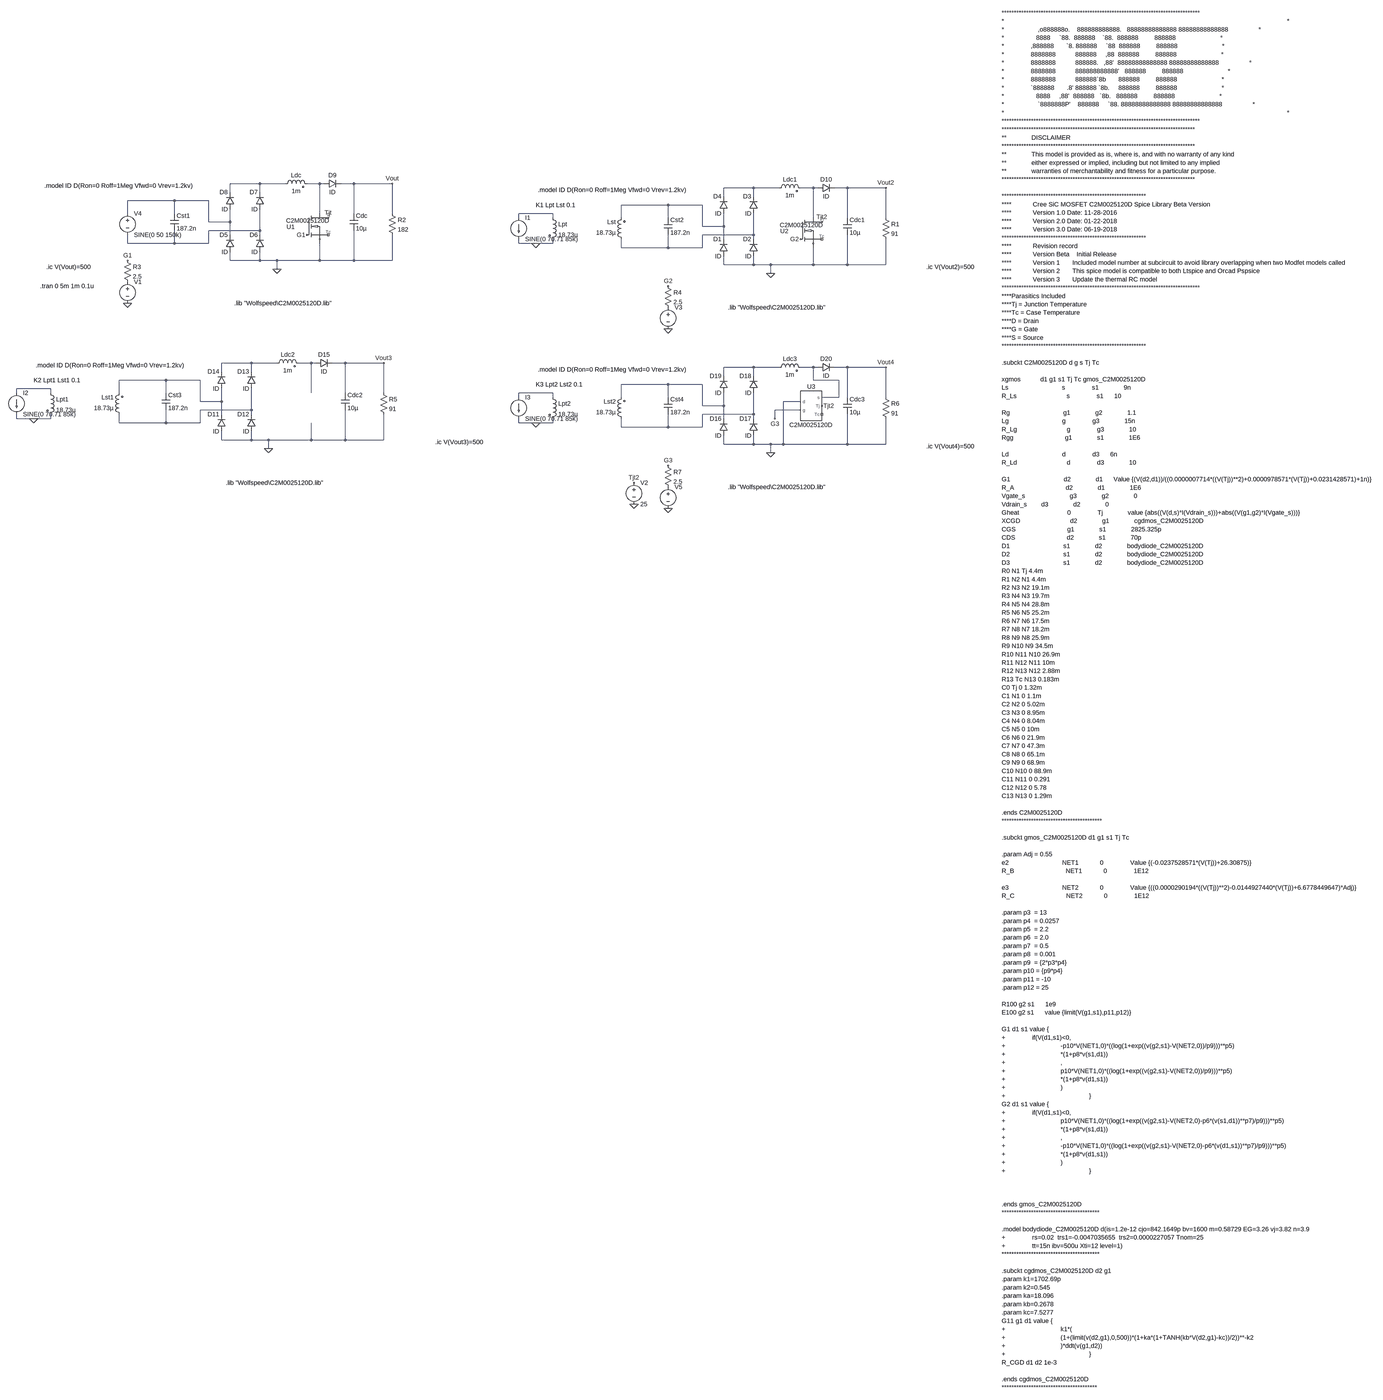
[diagram p0: schematic ShortCctReg.asc, whole sheet]
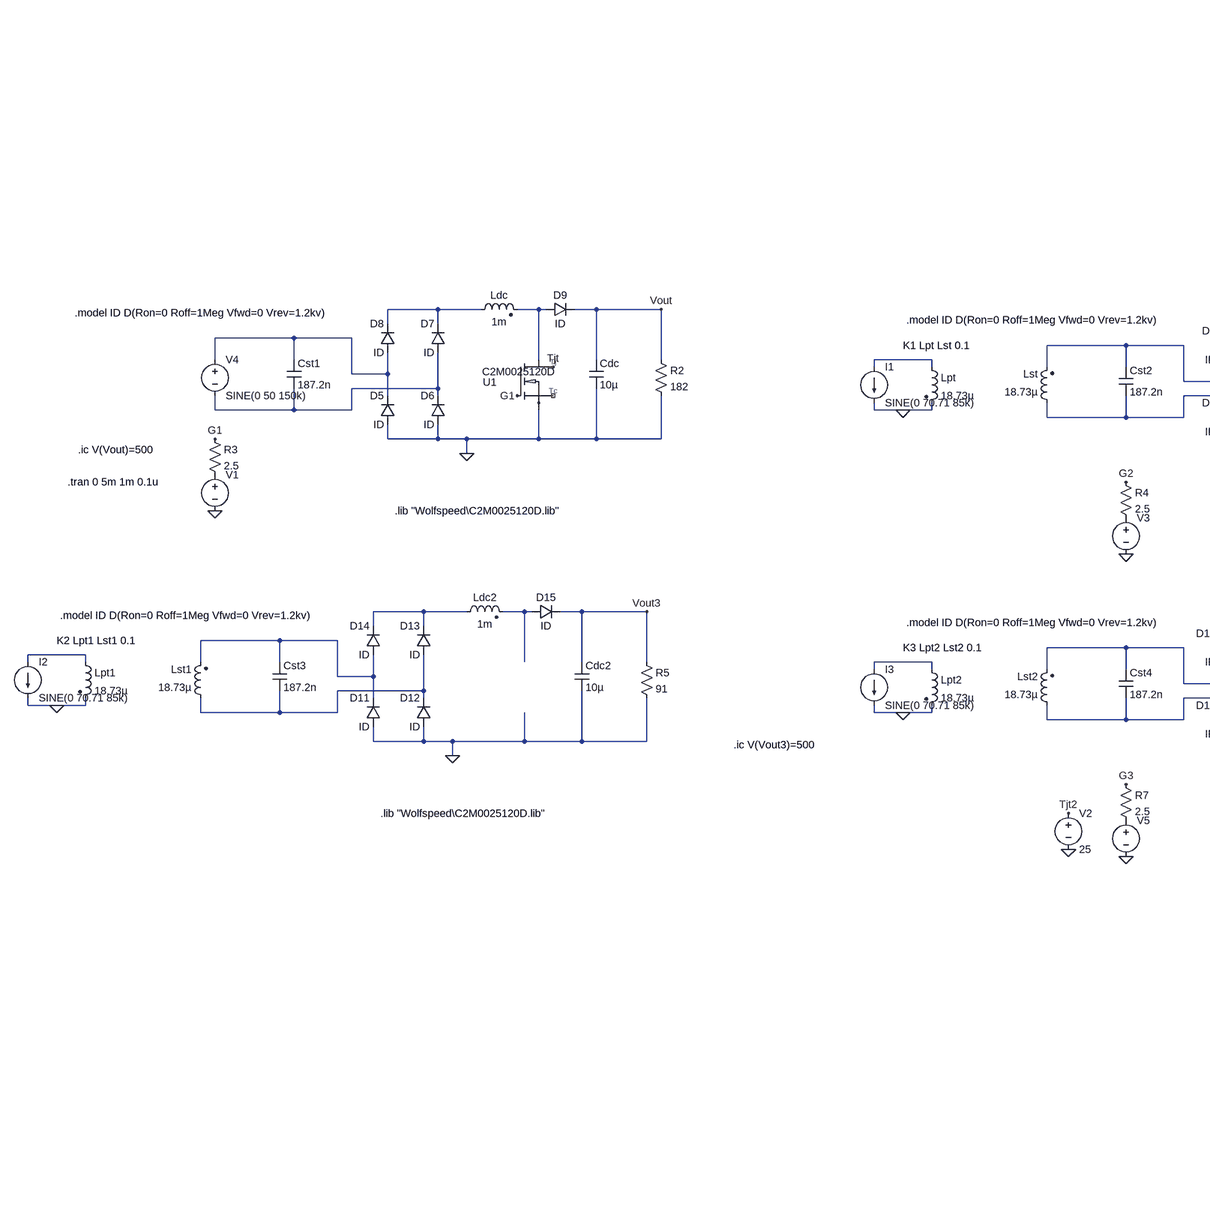
[diagram p1: schematic ShortCctReg.asc, part, row 1 of 2, column 1 of 2]
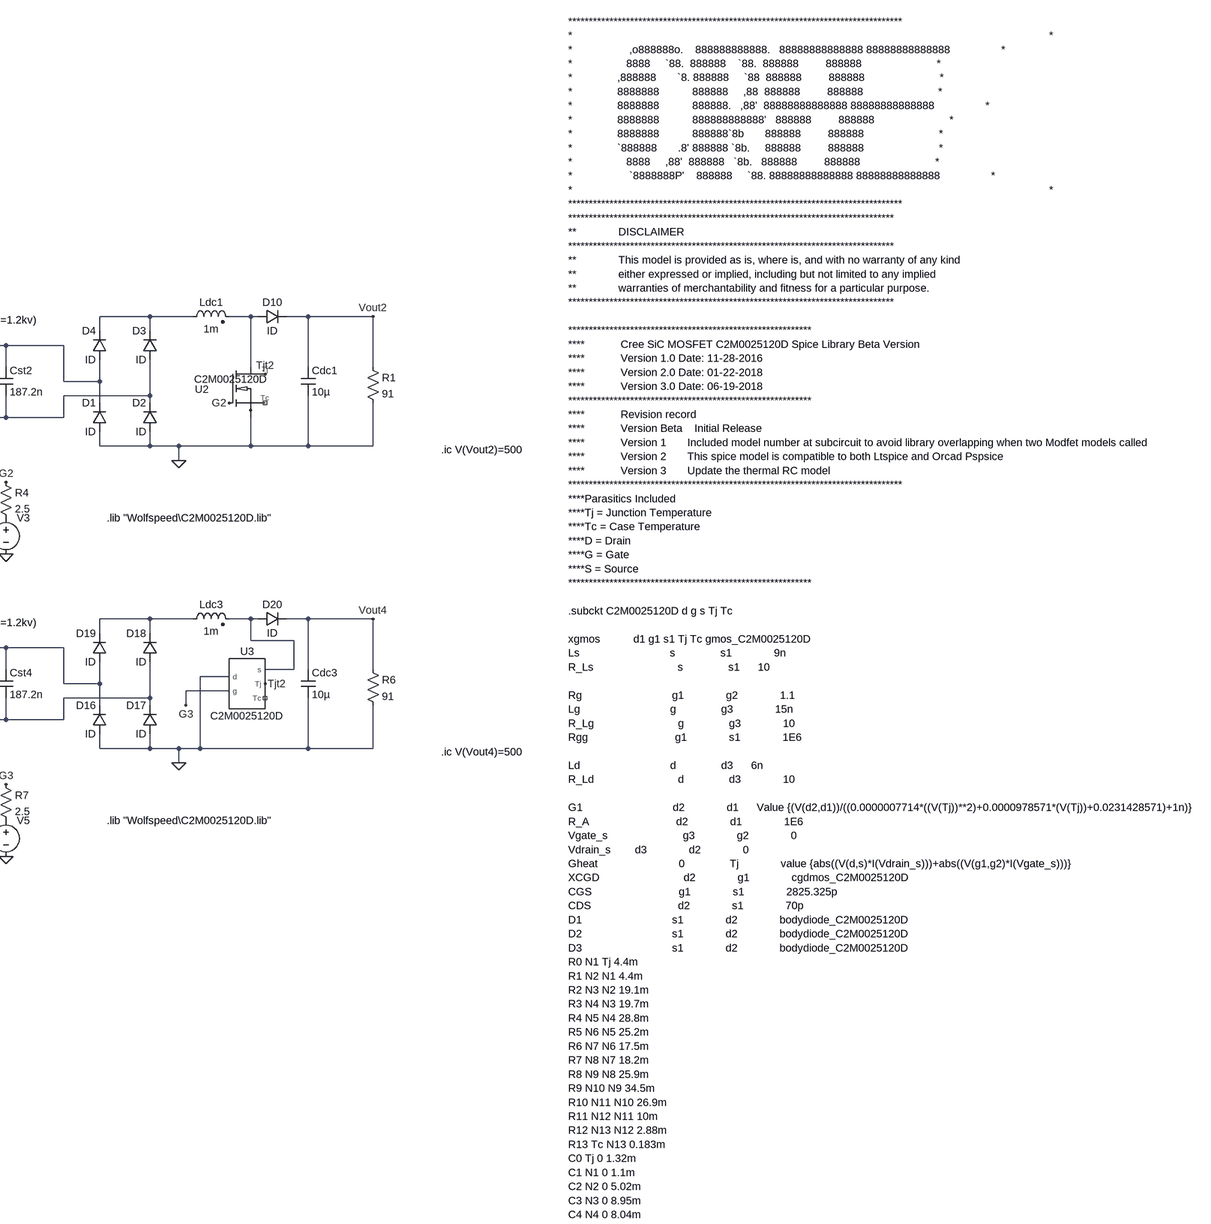
[diagram p2: schematic ShortCctReg.asc, part, row 1 of 2, column 2 of 2]
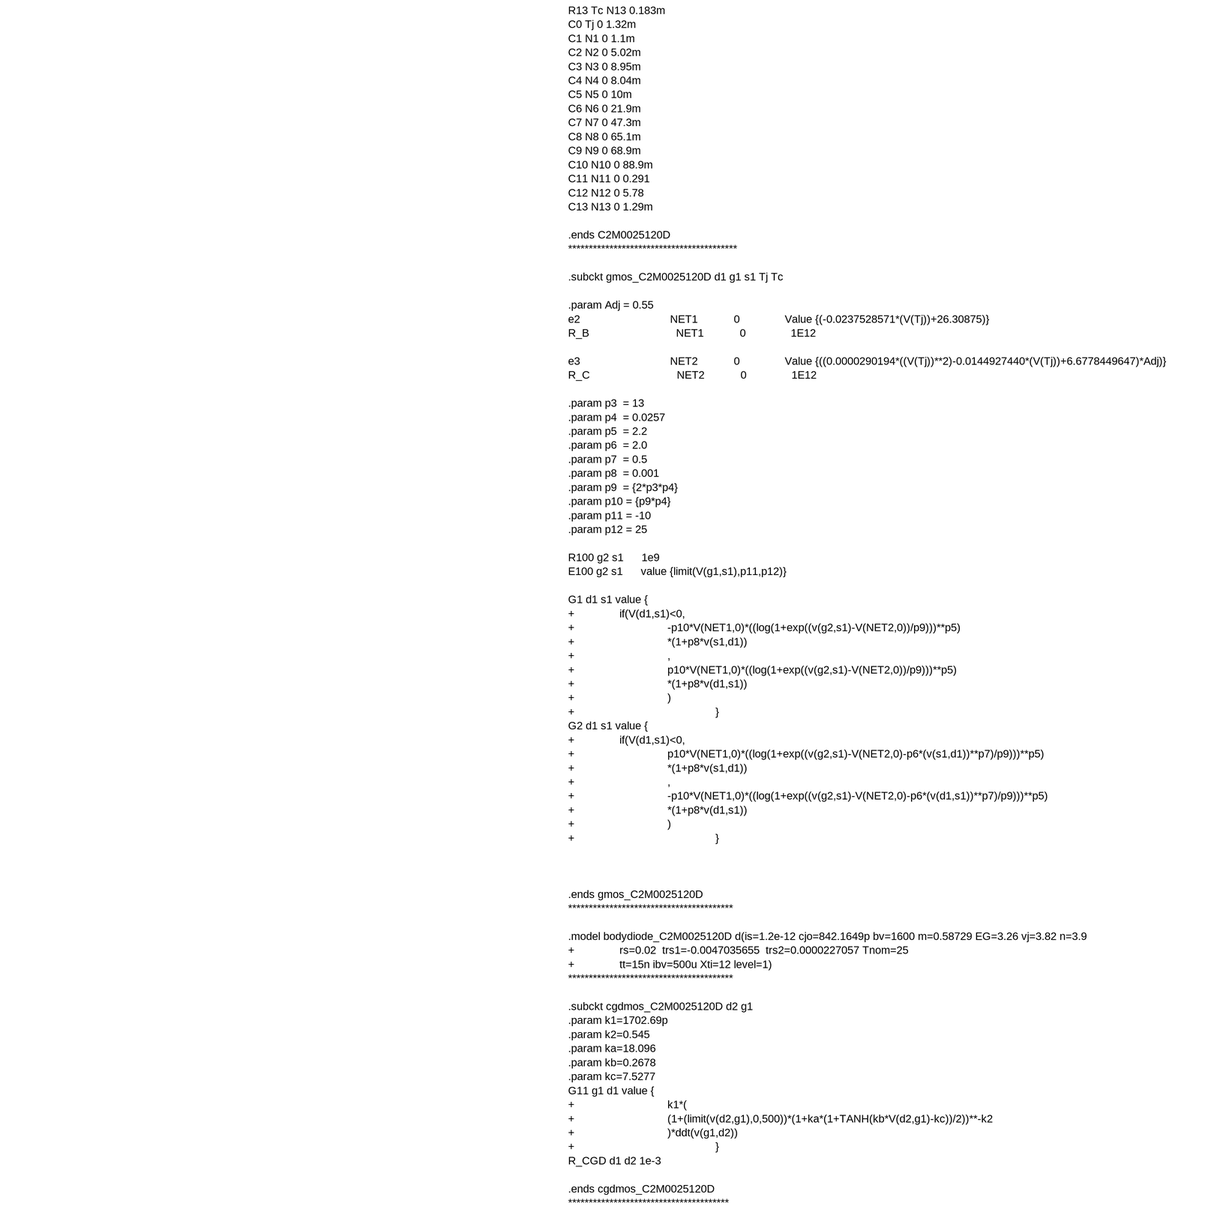
[diagram p3: schematic ShortCctReg.asc, part, row 2 of 2, column 2 of 2]
ShortCctReg.asc, the LTspice schematic file:
Version 4
SHEET 1 6276 4384
WIRE 544 416 432 416
WIRE 640 416 544 416
WIRE 768 416 720 416
WIRE 784 416 768 416
WIRE 896 416 848 416
WIRE 1040 416 896 416
WIRE 2592 432 2480 432
WIRE 2688 432 2592 432
WIRE 2816 432 2768 432
WIRE 2832 432 2816 432
WIRE 2944 432 2896 432
WIRE 3088 432 2944 432
WIRE 432 448 432 416
WIRE 544 448 544 416
WIRE 2480 464 2480 432
WIRE 2592 464 2592 432
WIRE 224 480 48 480
WIRE 352 480 224 480
WIRE 2272 496 2096 496
WIRE 2400 496 2272 496
WIRE 48 528 48 480
WIRE 224 528 224 480
WIRE 768 528 768 416
WIRE 896 528 896 416
WIRE 1040 528 1040 416
WIRE 1840 528 1712 528
WIRE 1712 544 1712 528
WIRE 1840 544 1840 528
WIRE 2096 544 2096 496
WIRE 2272 544 2272 496
WIRE 2816 544 2816 432
WIRE 2944 544 2944 432
WIRE 3088 544 3088 432
WIRE 352 560 352 480
WIRE 432 560 432 512
WIRE 432 560 352 560
WIRE 2400 576 2400 496
WIRE 2480 576 2480 528
WIRE 2480 576 2400 576
WIRE 544 592 544 512
WIRE 544 592 352 592
WIRE 432 608 432 560
WIRE 544 608 544 592
WIRE 2592 608 2592 528
WIRE 2592 608 2400 608
WIRE 2480 624 2480 576
WIRE 2592 624 2592 608
WIRE 48 640 48 608
WIRE 224 640 224 592
WIRE 224 640 48 640
WIRE 352 640 352 592
WIRE 352 640 224 640
WIRE 1712 640 1712 624
WIRE 1776 640 1712 640
WIRE 1840 640 1840 624
WIRE 1840 640 1776 640
WIRE 2096 656 2096 624
WIRE 2272 656 2272 608
WIRE 2272 656 2096 656
WIRE 2400 656 2400 608
WIRE 2400 656 2272 656
WIRE 432 704 432 672
WIRE 544 704 544 672
WIRE 544 704 432 704
WIRE 608 704 544 704
WIRE 768 704 768 640
WIRE 768 704 608 704
WIRE 896 704 896 592
WIRE 896 704 768 704
WIRE 1040 704 1040 608
WIRE 1040 704 896 704
WIRE 2480 720 2480 688
WIRE 2592 720 2592 688
WIRE 2592 720 2480 720
WIRE 2656 720 2592 720
WIRE 2816 720 2816 656
WIRE 2816 720 2656 720
WIRE 2944 720 2944 608
WIRE 2944 720 2816 720
WIRE 3088 720 3088 624
WIRE 3088 720 2944 720
WIRE 608 736 608 704
WIRE 2656 752 2656 720
WIRE 512 1088 400 1088
WIRE 608 1088 512 1088
WIRE 736 1088 688 1088
WIRE 752 1088 736 1088
WIRE 864 1088 816 1088
WIRE 1008 1088 864 1088
WIRE 2592 1104 2480 1104
WIRE 2688 1104 2592 1104
WIRE 2816 1104 2768 1104
WIRE 2832 1104 2816 1104
WIRE 2944 1104 2896 1104
WIRE 3088 1104 2944 1104
WIRE 400 1120 400 1088
WIRE 512 1120 512 1088
WIRE 2480 1136 2480 1104
WIRE 2592 1136 2592 1104
WIRE 192 1152 16 1152
WIRE 320 1152 192 1152
WIRE 2816 1152 2816 1104
WIRE 2912 1152 2816 1152
WIRE 2272 1168 2096 1168
WIRE 2400 1168 2272 1168
WIRE -240 1184 -368 1184
WIRE -368 1200 -368 1184
WIRE -240 1200 -240 1184
WIRE 16 1200 16 1152
WIRE 192 1200 192 1152
WIRE 736 1200 736 1088
WIRE 864 1200 864 1088
WIRE 1008 1200 1008 1088
WIRE 1840 1200 1712 1200
WIRE 1712 1216 1712 1200
WIRE 1840 1216 1840 1200
WIRE 2096 1216 2096 1168
WIRE 2272 1216 2272 1168
WIRE 2912 1216 2912 1152
WIRE 2912 1216 2848 1216
WIRE 2944 1216 2944 1104
WIRE 3088 1216 3088 1104
WIRE 320 1232 320 1152
WIRE 400 1232 400 1184
WIRE 400 1232 320 1232
WIRE 2768 1232 2704 1232
WIRE 2400 1248 2400 1168
WIRE 2480 1248 2480 1200
WIRE 2480 1248 2400 1248
WIRE 512 1264 512 1184
WIRE 512 1264 320 1264
WIRE 2768 1264 2672 1264
WIRE 400 1280 400 1232
WIRE 512 1280 512 1264
WIRE 2592 1280 2592 1200
WIRE 2592 1280 2400 1280
WIRE -368 1296 -368 1280
WIRE -304 1296 -368 1296
WIRE -240 1296 -240 1280
WIRE -240 1296 -304 1296
WIRE 2480 1296 2480 1248
WIRE 2592 1296 2592 1280
WIRE 2672 1296 2672 1264
WIRE 16 1312 16 1280
WIRE 192 1312 192 1264
WIRE 192 1312 16 1312
WIRE 320 1312 320 1264
WIRE 320 1312 192 1312
WIRE 1712 1312 1712 1296
WIRE 1776 1312 1712 1312
WIRE 1840 1312 1840 1296
WIRE 1840 1312 1776 1312
WIRE 2096 1328 2096 1296
WIRE 2272 1328 2272 1280
WIRE 2272 1328 2096 1328
WIRE 2400 1328 2400 1280
WIRE 2400 1328 2272 1328
WIRE 400 1376 400 1344
WIRE 512 1376 512 1344
WIRE 512 1376 400 1376
WIRE 576 1376 512 1376
WIRE 736 1376 736 1312
WIRE 736 1376 576 1376
WIRE 864 1376 864 1264
WIRE 864 1376 736 1376
WIRE 1008 1376 1008 1280
WIRE 1008 1376 864 1376
WIRE 2480 1392 2480 1360
WIRE 2592 1392 2592 1360
WIRE 2592 1392 2480 1392
WIRE 2656 1392 2592 1392
WIRE 2704 1392 2704 1232
WIRE 2704 1392 2656 1392
WIRE 2944 1392 2944 1280
WIRE 2944 1392 2704 1392
WIRE 3088 1392 3088 1296
WIRE 3088 1392 2944 1392
WIRE 576 1408 576 1376
WIRE 2656 1424 2656 1392
FLAG 608 736 0
FLAG 1040 416 Vout
FLAG 2144 1616 0
FLAG 48 864 0
FLAG 48 704 G1
FLAG 720 608 G1
FLAG 2144 1536 Tjt2
FLAG 800 544 Tjt
FLAG 2656 752 0
FLAG 3088 432 Vout2
FLAG 2768 624 G2
FLAG 2848 560 Tjt2
FLAG 2272 960 0
FLAG 2272 800 G2
FLAG 1776 640 0
FLAG 576 1408 0
FLAG 1008 1088 Vout3
FLAG -304 1296 0
FLAG 2656 1424 0
FLAG 3088 1104 Vout4
FLAG 2272 1632 0
FLAG 2272 1472 G3
FLAG 1776 1312 0
FLAG 2672 1296 G3
FLAG 2848 1248 Tjt2
SYMBOL cap 208 528 R0
SYMATTR InstName Cst1
SYMATTR Value 187.2n
SYMBOL diode 448 672 R180
WINDOW 0 24 64 Left 2
WINDOW 3 24 0 Left 2
SYMATTR InstName D5
SYMATTR Value ID
SYMBOL diode 560 672 R180
WINDOW 0 24 64 Left 2
WINDOW 3 24 0 Left 2
SYMATTR InstName D6
SYMATTR Value ID
SYMBOL diode 560 512 R180
WINDOW 0 24 64 Left 2
WINDOW 3 24 0 Left 2
SYMATTR InstName D7
SYMATTR Value ID
SYMBOL diode 448 512 R180
WINDOW 0 24 64 Left 2
WINDOW 3 24 0 Left 2
SYMATTR InstName D8
SYMATTR Value ID
SYMBOL cap 880 528 R0
SYMATTR InstName Cdc
SYMATTR Value 10µ
SYMBOL res 1024 512 R0
SYMATTR InstName R2
SYMATTR Value 182
SYMBOL ind2 624 432 R270
WINDOW 0 32 56 VTop 2
WINDOW 3 4 56 VBottom 2
SYMATTR InstName Ldc
SYMATTR Value 1m
SYMBOL diode 784 432 R270
WINDOW 0 32 32 VTop 2
WINDOW 3 0 32 VBottom 2
SYMATTR InstName D9
SYMATTR Value ID
SYMBOL voltage 48 768 R0
WINDOW 3 24 96 Invisible 2
WINDOW 123 0 0 Left 0
WINDOW 39 0 0 Left 0
SYMATTR Value PULSE(0 12 0 0 0 0.1u 1u)
SYMATTR InstName V1
SYMBOL voltage 2144 1520 R0
WINDOW 123 0 0 Left 0
WINDOW 39 0 0 Left 0
SYMATTR InstName V2
SYMATTR Value 25
SYMBOL res 32 688 R0
SYMATTR InstName R3
SYMATTR Value 2.5
SYMBOL nmos_TO247_3L 720 528 R0
SYMATTR Value C2M0025120D
SYMATTR InstName U1
SYMBOL voltage 48 512 R0
WINDOW 123 0 0 Left 0
WINDOW 39 0 0 Left 0
SYMATTR InstName V4
SYMATTR Value SINE(0 50 150k)
SYMBOL cap 2256 544 R0
SYMATTR InstName Cst2
SYMATTR Value 187.2n
SYMBOL diode 2496 688 R180
WINDOW 0 24 64 Left 2
WINDOW 3 24 0 Left 2
SYMATTR InstName D1
SYMATTR Value ID
SYMBOL diode 2608 688 R180
WINDOW 0 24 64 Left 2
WINDOW 3 24 0 Left 2
SYMATTR InstName D2
SYMATTR Value ID
SYMBOL diode 2608 528 R180
WINDOW 0 24 64 Left 2
WINDOW 3 24 0 Left 2
SYMATTR InstName D3
SYMATTR Value ID
SYMBOL diode 2496 528 R180
WINDOW 0 24 64 Left 2
WINDOW 3 24 0 Left 2
SYMATTR InstName D4
SYMATTR Value ID
SYMBOL cap 2928 544 R0
SYMATTR InstName Cdc1
SYMATTR Value 10µ
SYMBOL res 3072 528 R0
SYMATTR InstName R1
SYMATTR Value 91
SYMBOL ind2 2672 448 R270
WINDOW 0 32 56 VTop 2
WINDOW 3 4 56 VBottom 2
SYMATTR InstName Ldc1
SYMATTR Value 1m
SYMBOL diode 2832 448 R270
WINDOW 0 32 32 VTop 2
WINDOW 3 0 32 VBottom 2
SYMATTR InstName D10
SYMATTR Value ID
SYMBOL nmos_TO247_3L 2768 544 R0
SYMATTR Value C2M0025120D
SYMATTR InstName U2
SYMBOL current 1712 544 R0
WINDOW 123 0 0 Left 0
WINDOW 39 0 0 Left 0
SYMATTR InstName I1
SYMATTR Value SINE(0 70.71 85k)
SYMBOL ind2 1824 528 R0
SYMATTR InstName Lpt
SYMATTR Value 18.73µ
SYMATTR Type ind
SYMBOL ind2 2112 640 R180
WINDOW 0 36 80 Left 2
WINDOW 3 36 40 Left 2
SYMATTR InstName Lst
SYMATTR Value 18.73µ
SYMATTR Type ind
SYMBOL voltage 2272 864 R0
WINDOW 3 24 96 Invisible 2
WINDOW 123 0 0 Left 0
WINDOW 39 0 0 Left 0
SYMATTR Value PULSE(0 12 0 0 0 0.5u 1u)
SYMATTR InstName V3
SYMBOL res 2256 784 R0
SYMATTR InstName R4
SYMATTR Value 2.5
SYMBOL cap 176 1200 R0
SYMATTR InstName Cst3
SYMATTR Value 187.2n
SYMBOL diode 416 1344 R180
WINDOW 0 24 64 Left 2
WINDOW 3 24 0 Left 2
SYMATTR InstName D11
SYMATTR Value ID
SYMBOL diode 528 1344 R180
WINDOW 0 24 64 Left 2
WINDOW 3 24 0 Left 2
SYMATTR InstName D12
SYMATTR Value ID
SYMBOL diode 528 1184 R180
WINDOW 0 24 64 Left 2
WINDOW 3 24 0 Left 2
SYMATTR InstName D13
SYMATTR Value ID
SYMBOL diode 416 1184 R180
WINDOW 0 24 64 Left 2
WINDOW 3 24 0 Left 2
SYMATTR InstName D14
SYMATTR Value ID
SYMBOL cap 848 1200 R0
SYMATTR InstName Cdc2
SYMATTR Value 10µ
SYMBOL res 992 1184 R0
SYMATTR InstName R5
SYMATTR Value 91
SYMBOL ind2 592 1104 R270
WINDOW 0 32 56 VTop 2
WINDOW 3 4 56 VBottom 2
SYMATTR InstName Ldc2
SYMATTR Value 1m
SYMBOL diode 752 1104 R270
WINDOW 0 32 32 VTop 2
WINDOW 3 0 32 VBottom 2
SYMATTR InstName D15
SYMATTR Value ID
SYMBOL current -368 1200 R0
WINDOW 123 0 0 Left 0
WINDOW 39 0 0 Left 0
SYMATTR InstName I2
SYMATTR Value SINE(0 70.71 85k)
SYMBOL ind2 -256 1184 R0
SYMATTR InstName Lpt1
SYMATTR Value 18.73µ
SYMATTR Type ind
SYMBOL ind2 32 1296 R180
WINDOW 0 36 80 Left 2
WINDOW 3 36 40 Left 2
SYMATTR InstName Lst1
SYMATTR Value 18.73µ
SYMATTR Type ind
SYMBOL cap 2256 1216 R0
SYMATTR InstName Cst4
SYMATTR Value 187.2n
SYMBOL diode 2496 1360 R180
WINDOW 0 24 64 Left 2
WINDOW 3 24 0 Left 2
SYMATTR InstName D16
SYMATTR Value ID
SYMBOL diode 2608 1360 R180
WINDOW 0 24 64 Left 2
WINDOW 3 24 0 Left 2
SYMATTR InstName D17
SYMATTR Value ID
SYMBOL diode 2608 1200 R180
WINDOW 0 24 64 Left 2
WINDOW 3 24 0 Left 2
SYMATTR InstName D18
SYMATTR Value ID
SYMBOL diode 2496 1200 R180
WINDOW 0 24 64 Left 2
WINDOW 3 24 0 Left 2
SYMATTR InstName D19
SYMATTR Value ID
SYMBOL cap 2928 1216 R0
SYMATTR InstName Cdc3
SYMATTR Value 10µ
SYMBOL res 3072 1200 R0
SYMATTR InstName R6
SYMATTR Value 91
SYMBOL ind2 2672 1120 R270
WINDOW 0 32 56 VTop 2
WINDOW 3 4 56 VBottom 2
SYMATTR InstName Ldc3
SYMATTR Value 1m
SYMBOL diode 2832 1120 R270
WINDOW 0 32 32 VTop 2
WINDOW 3 0 32 VBottom 2
SYMATTR InstName D20
SYMATTR Value ID
SYMBOL current 1712 1216 R0
WINDOW 123 0 0 Left 0
WINDOW 39 0 0 Left 0
SYMATTR InstName I3
SYMATTR Value SINE(0 70.71 85k)
SYMBOL ind2 1824 1200 R0
SYMATTR InstName Lpt2
SYMATTR Value 18.73µ
SYMATTR Type ind
SYMBOL ind2 2112 1312 R180
WINDOW 0 36 80 Left 2
WINDOW 3 36 40 Left 2
SYMATTR InstName Lst2
SYMATTR Value 18.73µ
SYMATTR Type ind
SYMBOL voltage 2272 1536 R0
WINDOW 3 24 96 Invisible 2
WINDOW 123 0 0 Left 0
WINDOW 39 0 0 Left 0
SYMATTR Value PULSE(0 20 0 0 0 0.5u 1u)
SYMATTR InstName V5
SYMBOL res 2256 1456 R0
SYMATTR InstName R7
SYMATTR Value 2.5
SYMBOL C2M0025120D 2800 1248 R0
SYMATTR InstName U3
TEXT -280 800 Left 2 !.tran 0 5m 1m 0.1u
TEXT -264 424 Left 2 !.model ID D(Ron=0 Roff=1Meg Vfwd=0 Vrev=1.2kv)
TEXT -256 728 Left 2 !.ic V(Vout)=500
TEXT 448 864 Left 2 !.lib "Wolfspeed\\C2M0025120D.lib"
TEXT 1784 440 Left 2 !.model ID D(Ron=0 Roff=1Meg Vfwd=0 Vrev=1.2kv)
TEXT 2496 880 Left 2 !.lib "Wolfspeed\\C2M0025120D.lib"
TEXT 3328 728 Left 2 !.ic V(Vout2)=500
TEXT 1776 496 Left 2 !K1 Lpt Lst 0.1
TEXT -296 1096 Left 2 !.model ID D(Ron=0 Roff=1Meg Vfwd=0 Vrev=1.2kv)
TEXT 416 1536 Left 2 !.lib "Wolfspeed\\C2M0025120D.lib"
TEXT 1248 1384 Left 2 !.ic V(Vout3)=500
TEXT -304 1152 Left 2 !K2 Lpt1 Lst1 0.1
TEXT 1784 1112 Left 2 !.model ID D(Ron=0 Roff=1Meg Vfwd=0 Vrev=1.2kv)
TEXT 2496 1552 Left 2 !.lib "Wolfspeed\\C2M0025120D.lib"
TEXT 3328 1400 Left 2 !.ic V(Vout4)=500
TEXT 1776 1168 Left 2 !K3 Lpt2 Lst2 0.1
TEXT 4720 -224 Left 2 !*********************************************************************************\n*                                                                                                                                                               *\n*                   ,o888888o.    888888888888.   88888888888888 88888888888888                 *\n*                  8888     `88.  888888    `88.  888888         888888                         *\n*               ,888888       `8. 888888     `88  888888         888888                         *\n*               8888888           888888     ,88  888888         888888                         *\n*               8888888           888888.   ,88'  88888888888888 88888888888888                 *\n*               8888888           888888888888'   888888         888888                         *\n*               8888888           888888`8b       888888         888888                         *\n*               `888888       .8' 888888 `8b.     888888         888888                         *\n*                  8888     ,88'  888888   `8b.   888888         888888                         *\n*                   `8888888P'    888888     `88. 88888888888888 88888888888888                 *\n*                                                                                                                                                               *\n*********************************************************************************\n*******************************************************************************\n**              DISCLAIMER\n*******************************************************************************\n**              This model is provided as is, where is, and with no warranty of any kind\n**              either expressed or implied, including but not limited to any implied \n**              warranties of merchantability and fitness for a particular purpose.\n*******************************************************************************\n \n***********************************************************\n****            Cree SiC MOSFET C2M0025120D Spice Library Beta Version\n****            Version 1.0 Date: 11-28-2016\n****            Version 2.0 Date: 01-22-2018\n****            Version 3.0 Date: 06-19-2018\n***********************************************************\n****            Revision record\n****            Version Beta    Initial Release\n****            Version 1       Included model number at subcircuit to avoid library overlapping when two Modfet models called\n****            Version 2       This spice model is compatible to both Ltspice and Orcad Pspsice\n****            Version 3       Update the thermal RC model\n*********************************************************************************\n****Parasitics Included\n****Tj = Junction Temperature\n****Tc = Case Temperature\n****D = Drain\n****G = Gate\n****S = Source\n***********************************************************\n \n.subckt C2M0025120D d g s Tj Tc\n \nxgmos           d1 g1 s1 Tj Tc gmos_C2M0025120D \nLs                              s               s1              9n\nR_Ls                            s               s1      10\n \nRg                              g1              g2              1.1\nLg                              g               g3              15n\nR_Lg                            g               g3              10\nRgg                             g1              s1              1E6\n \nLd                              d               d3      6n\nR_Ld                            d               d3              10\n \nG1                              d2              d1      Value {(V(d2,d1))/((0.0000007714*((V(Tj))**2)+0.0000978571*(V(Tj))+0.0231428571)+1n)}\nR_A                             d2              d1              1E6\nVgate_s                         g3              g2              0\nVdrain_s        d3              d2              0\nGheat                           0               Tj              value {abs((V(d,s)*I(Vdrain_s)))+abs((V(g1,g2)*I(Vgate_s)))}\nXCGD                            d2              g1              cgdmos_C2M0025120D \nCGS                             g1              s1              2825.325p\nCDS                             d2              s1              70p\nD1                              s1              d2              bodydiode_C2M0025120D\nD2                              s1              d2              bodydiode_C2M0025120D\nD3                              s1              d2              bodydiode_C2M0025120D\nR0 N1 Tj 4.4m\nR1 N2 N1 4.4m\nR2 N3 N2 19.1m\nR3 N4 N3 19.7m\nR4 N5 N4 28.8m\nR5 N6 N5 25.2m\nR6 N7 N6 17.5m\nR7 N8 N7 18.2m\nR8 N9 N8 25.9m\nR9 N10 N9 34.5m\nR10 N11 N10 26.9m\nR11 N12 N11 10m\nR12 N13 N12 2.88m\nR13 Tc N13 0.183m\nC0 Tj 0 1.32m\nC1 N1 0 1.1m\nC2 N2 0 5.02m\nC3 N3 0 8.95m\nC4 N4 0 8.04m\nC5 N5 0 10m\nC6 N6 0 21.9m\nC7 N7 0 47.3m\nC8 N8 0 65.1m\nC9 N9 0 68.9m\nC10 N10 0 88.9m\nC11 N11 0 0.291\nC12 N12 0 5.78\nC13 N13 0 1.29m\n \n.ends C2M0025120D \n*****************************************\n \n.subckt gmos_C2M0025120D d1 g1 s1 Tj Tc\n \n.param Adj = 0.55\ne2                              NET1            0               Value {(-0.0237528571*(V(Tj))+26.30875)}\nR_B                             NET1            0               1E12\n \ne3                              NET2            0               Value {((0.0000290194*((V(Tj))**2)-0.0144927440*(V(Tj))+6.6778449647)*Adj)}\nR_C                             NET2            0               1E12\n \n.param p3  = 13\n.param p4  = 0.0257                                                                                                                                                                             \n.param p5  = 2.2\n.param p6  = 2.0\n.param p7  = 0.5\n.param p8  = 0.001\n.param p9  = {2*p3*p4}\n.param p10 = {p9*p4}\n.param p11 = -10\n.param p12 = 25\n \nR100 g2 s1      1e9\nE100 g2 s1      value {limit(V(g1,s1),p11,p12)} \n \nG1 d1 s1 value {\n+               if(V(d1,s1)<0,\n+                               -p10*V(NET1,0)*((log(1+exp((v(g2,s1)-V(NET2,0))/p9)))**p5)\n+                               *(1+p8*v(s1,d1))\n+                               ,\n+                               p10*V(NET1,0)*((log(1+exp((v(g2,s1)-V(NET2,0))/p9)))**p5)\n+                               *(1+p8*v(d1,s1))\n+                               )\n+                                               }\nG2 d1 s1 value {\n+               if(V(d1,s1)<0,\n+                               p10*V(NET1,0)*((log(1+exp((v(g2,s1)-V(NET2,0)-p6*(v(s1,d1))**p7)/p9)))**p5)\n+                               *(1+p8*v(s1,d1))\n+                               ,\n+                               -p10*V(NET1,0)*((log(1+exp((v(g2,s1)-V(NET2,0)-p6*(v(d1,s1))**p7)/p9)))**p5)\n+                               *(1+p8*v(d1,s1))\n+                               )\n+                                               }\n \n\n \n.ends gmos_C2M0025120D\n****************************************\n \n.model bodydiode_C2M0025120D d(is=1.2e-12 cjo=842.1649p bv=1600 m=0.58729 EG=3.26 vj=3.82 n=3.9 \n+               rs=0.02  trs1=-0.0047035655  trs2=0.0000227057 Tnom=25\n+               tt=15n ibv=500u Xti=12 level=1)\n****************************************\n \n.subckt cgdmos_C2M0025120D d2 g1\n.param k1=1702.69p\n.param k2=0.545\n.param ka=18.096\n.param kb=0.2678\n.param kc=7.5277\nG11 g1 d1 value {\n+                               k1*(\n+                               (1+(limit(v(d2,g1),0,500))*(1+ka*(1+TANH(kb*V(d2,g1)-kc))/2))**-k2\n+                               )*ddt(v(g1,d2))\n+                                               }\nR_CGD d1 d2 1e-3\n \n.ends cgdmos_C2M0025120D\n***************************************

The netlist it stands for:
* ShortCctReg.asc
Cst1 N005 N008 187.2n
D5 0 N005 ID
D6 0 N008 ID
D7 N008 N001 ID
D8 N005 N001 ID
Cdc Vout 0 10µ
R2 Vout 0 182
Ldc N001 N002 1m
D9 N002 Vout ID
V1 P001 0 PULSE(0 12 0 0 0 0.1u 1u)
V2 Tjt2 0 25
R3 G1 P001 2.5
XU1 N002 G1 0 Tjt NC_01 C2M0025120D  ; pins D G S Tj Tc
V4 N005 N008 SINE(0 50 150k)
Cst2 N006 N009 187.2n
D1 0 N006 ID
D2 0 N009 ID
D3 N009 N003 ID
D4 N006 N003 ID
Cdc1 Vout2 0 10µ
R1 Vout2 0 91
Ldc1 N003 N004 1m
D10 N004 Vout2 ID
XU2 N004 G2 0 Tjt2 NC_02 C2M0025120D  ; pins D G S Tj Tc
I1 N007 0 SINE(0 70.71 85k)
Lpt N007 0 18.73µ
Lst N009 N006 18.73µ
V3 P002 0 PULSE(0 12 0 0 0 0.5u 1u)
R4 G2 P002 2.5
Cst3 N014 N018 187.2n
D11 0 N014 ID
D12 0 N018 ID
D13 N018 N010 ID
D14 N014 N010 ID
Cdc2 Vout3 0 10µ
R5 Vout3 0 91
Ldc2 N010 N011 1m
D15 N011 Vout3 ID
I2 N016 0 SINE(0 70.71 85k)
Lpt1 N016 0 18.73µ
Lst1 N018 N014 18.73µ
Cst4 N015 N019 187.2n
D16 0 N015 ID
D17 0 N019 ID
D18 N019 N012 ID
D19 N015 N012 ID
Cdc3 Vout4 0 10µ
R6 Vout4 0 91
Ldc3 N012 N013 1m
D20 N013 Vout4 ID
I3 N017 0 SINE(0 70.71 85k)
Lpt2 N017 0 18.73µ
Lst2 N019 N015 18.73µ
V5 P003 0 PULSE(0 20 0 0 0 0.5u 1u)
R7 G3 P003 2.5
XU3 0 G3 N013 Tjt2 NC_03 C2M0025120D  ; pins d g s Tj Tc
.model D D
.lib standard.dio
.tran 0 5m 1m 0.1u
.model ID D(Ron=0 Roff=1Meg Vfwd=0 Vrev=1.2kv)
.ic V(Vout)=500
.lib "Wolfspeed\C2M0025120D.lib"
.model ID D(Ron=0 Roff=1Meg Vfwd=0 Vrev=1.2kv)
.lib "Wolfspeed\C2M0025120D.lib"
.ic V(Vout2)=500
K1 Lpt Lst 0.1
.model ID D(Ron=0 Roff=1Meg Vfwd=0 Vrev=1.2kv)
.lib "Wolfspeed\C2M0025120D.lib"
.ic V(Vout3)=500
K2 Lpt1 Lst1 0.1
.model ID D(Ron=0 Roff=1Meg Vfwd=0 Vrev=1.2kv)
.lib "Wolfspeed\C2M0025120D.lib"
.ic V(Vout4)=500
K3 Lpt2 Lst2 0.1
*********************************************************************************
*                                                                                                                                                               *
*                   ,o888888o.    888888888888.   88888888888888 88888888888888                 *
*                  8888     `88.  888888    `88.  888888         888888                         *
*               ,888888       `8. 888888     `88  888888         888888                         *
*               8888888           888888     ,88  888888         888888                         *
*               8888888           888888.   ,88'  88888888888888 88888888888888                 *
*               8888888           888888888888'   888888         888888                         *
*               8888888           888888`8b       888888         888888                         *
*               `888888       .8' 888888 `8b.     888888         888888                         *
*                  8888     ,88'  888888   `8b.   888888         888888                         *
*                   `8888888P'    888888     `88. 88888888888888 88888888888888                 *
*                                                                                                                                                               *
*********************************************************************************
*******************************************************************************
**              DISCLAIMER
*******************************************************************************
**              This model is provided as is, where is, and with no warranty of any kind
**              either expressed or implied, including but not limited to any implied
**              warranties of merchantability and fitness for a particular purpose.
*******************************************************************************
***********************************************************
****            Cree SiC MOSFET C2M0025120D Spice Library Beta Version
****            Version 1.0 Date: 11-28-2016
****            Version 2.0 Date: 01-22-2018
****            Version 3.0 Date: 06-19-2018
***********************************************************
****            Revision record
****            Version Beta    Initial Release
****            Version 1       Included model number at subcircuit to avoid library overlapping when two Modfet models called
****            Version 2       This spice model is compatible to both Ltspice and Orcad Pspsice
****            Version 3       Update the thermal RC model
*********************************************************************************
****Parasitics Included
****Tj = Junction Temperature
****Tc = Case Temperature
****D = Drain
****G = Gate
****S = Source
***********************************************************
.subckt C2M0025120D d g s Tj Tc
xgmos           d1 g1 s1 Tj Tc gmos_C2M0025120D
Ls                              s               s1              9n
R_Ls                            s               s1      10
Rg                              g1              g2              1.1
Lg                              g               g3              15n
R_Lg                            g               g3              10
Rgg                             g1              s1              1E6
Ld                              d               d3      6n
R_Ld                            d               d3              10
G1                              d2              d1      Value {(V(d2,d1))/((0.0000007714*((V(Tj))**2)+0.0000978571*(V(Tj))+0.0231428571)+1n)}
R_A                             d2              d1              1E6
Vgate_s                         g3              g2              0
Vdrain_s        d3              d2              0
Gheat                           0               Tj              value {abs((V(d,s)*I(Vdrain_s)))+abs((V(g1,g2)*I(Vgate_s)))}
XCGD                            d2              g1              cgdmos_C2M0025120D
CGS                             g1              s1              2825.325p
CDS                             d2              s1              70p
D1                              s1              d2              bodydiode_C2M0025120D
D2                              s1              d2              bodydiode_C2M0025120D
D3                              s1              d2              bodydiode_C2M0025120D
R0 N1 Tj 4.4m
R1 N2 N1 4.4m
R2 N3 N2 19.1m
R3 N4 N3 19.7m
R4 N5 N4 28.8m
R5 N6 N5 25.2m
R6 N7 N6 17.5m
R7 N8 N7 18.2m
R8 N9 N8 25.9m
R9 N10 N9 34.5m
R10 N11 N10 26.9m
R11 N12 N11 10m
R12 N13 N12 2.88m
R13 Tc N13 0.183m
C0 Tj 0 1.32m
C1 N1 0 1.1m
C2 N2 0 5.02m
C3 N3 0 8.95m
C4 N4 0 8.04m
C5 N5 0 10m
C6 N6 0 21.9m
C7 N7 0 47.3m
C8 N8 0 65.1m
C9 N9 0 68.9m
C10 N10 0 88.9m
C11 N11 0 0.291
C12 N12 0 5.78
C13 N13 0 1.29m
.ends C2M0025120D
*****************************************
.subckt gmos_C2M0025120D d1 g1 s1 Tj Tc
.param Adj = 0.55
e2                              NET1            0               Value {(-0.0237528571*(V(Tj))+26.30875)}
R_B                             NET1            0               1E12
e3                              NET2            0               Value {((0.0000290194*((V(Tj))**2)-0.0144927440*(V(Tj))+6.6778449647)*Adj)}
R_C                             NET2            0               1E12
.param p3  = 13
.param p4  = 0.0257
.param p5  = 2.2
.param p6  = 2.0
.param p7  = 0.5
.param p8  = 0.001
.param p9  = {2*p3*p4}
.param p10 = {p9*p4}
.param p11 = -10
.param p12 = 25
R100 g2 s1      1e9
E100 g2 s1      value {limit(V(g1,s1),p11,p12)}
G1 d1 s1 value {
+               if(V(d1,s1)<0,
+                               -p10*V(NET1,0)*((log(1+exp((v(g2,s1)-V(NET2,0))/p9)))**p5)
+                               *(1+p8*v(s1,d1))
+                               ,
+                               p10*V(NET1,0)*((log(1+exp((v(g2,s1)-V(NET2,0))/p9)))**p5)
+                               *(1+p8*v(d1,s1))
+                               )
+                                               }
G2 d1 s1 value {
+               if(V(d1,s1)<0,
+                               p10*V(NET1,0)*((log(1+exp((v(g2,s1)-V(NET2,0)-p6*(v(s1,d1))**p7)/p9)))**p5)
+                               *(1+p8*v(s1,d1))
+                               ,
+                               -p10*V(NET1,0)*((log(1+exp((v(g2,s1)-V(NET2,0)-p6*(v(d1,s1))**p7)/p9)))**p5)
+                               *(1+p8*v(d1,s1))
+                               )
+                                               }
.ends gmos_C2M0025120D
****************************************
.model bodydiode_C2M0025120D d(is=1.2e-12 cjo=842.1649p bv=1600 m=0.58729 EG=3.26 vj=3.82 n=3.9
+               rs=0.02  trs1=-0.0047035655  trs2=0.0000227057 Tnom=25
+               tt=15n ibv=500u Xti=12 level=1)
****************************************
.subckt cgdmos_C2M0025120D d2 g1
.param k1=1702.69p
.param k2=0.545
.param ka=18.096
.param kb=0.2678
.param kc=7.5277
G11 g1 d1 value {
+                               k1*(
+                               (1+(limit(v(d2,g1),0,500))*(1+ka*(1+TANH(kb*V(d2,g1)-kc))/2))**-k2
+                               )*ddt(v(g1,d2))
+                                               }
R_CGD d1 d2 1e-3
.ends cgdmos_C2M0025120D
***************************************
.lib C:\Users\Manoj\Documents\GitHub\2020-srw-rc-car\SecondaryConverter\all_ltspice_device_models\all_sic_mosfet_ltspice_models\C2M0025120D.lib
.backanno
.end